# Altium schematic sheet STM32.SchDoc
size A3; DocumentNumber: 3; SheetNumber: 3; SheetTotal: 4
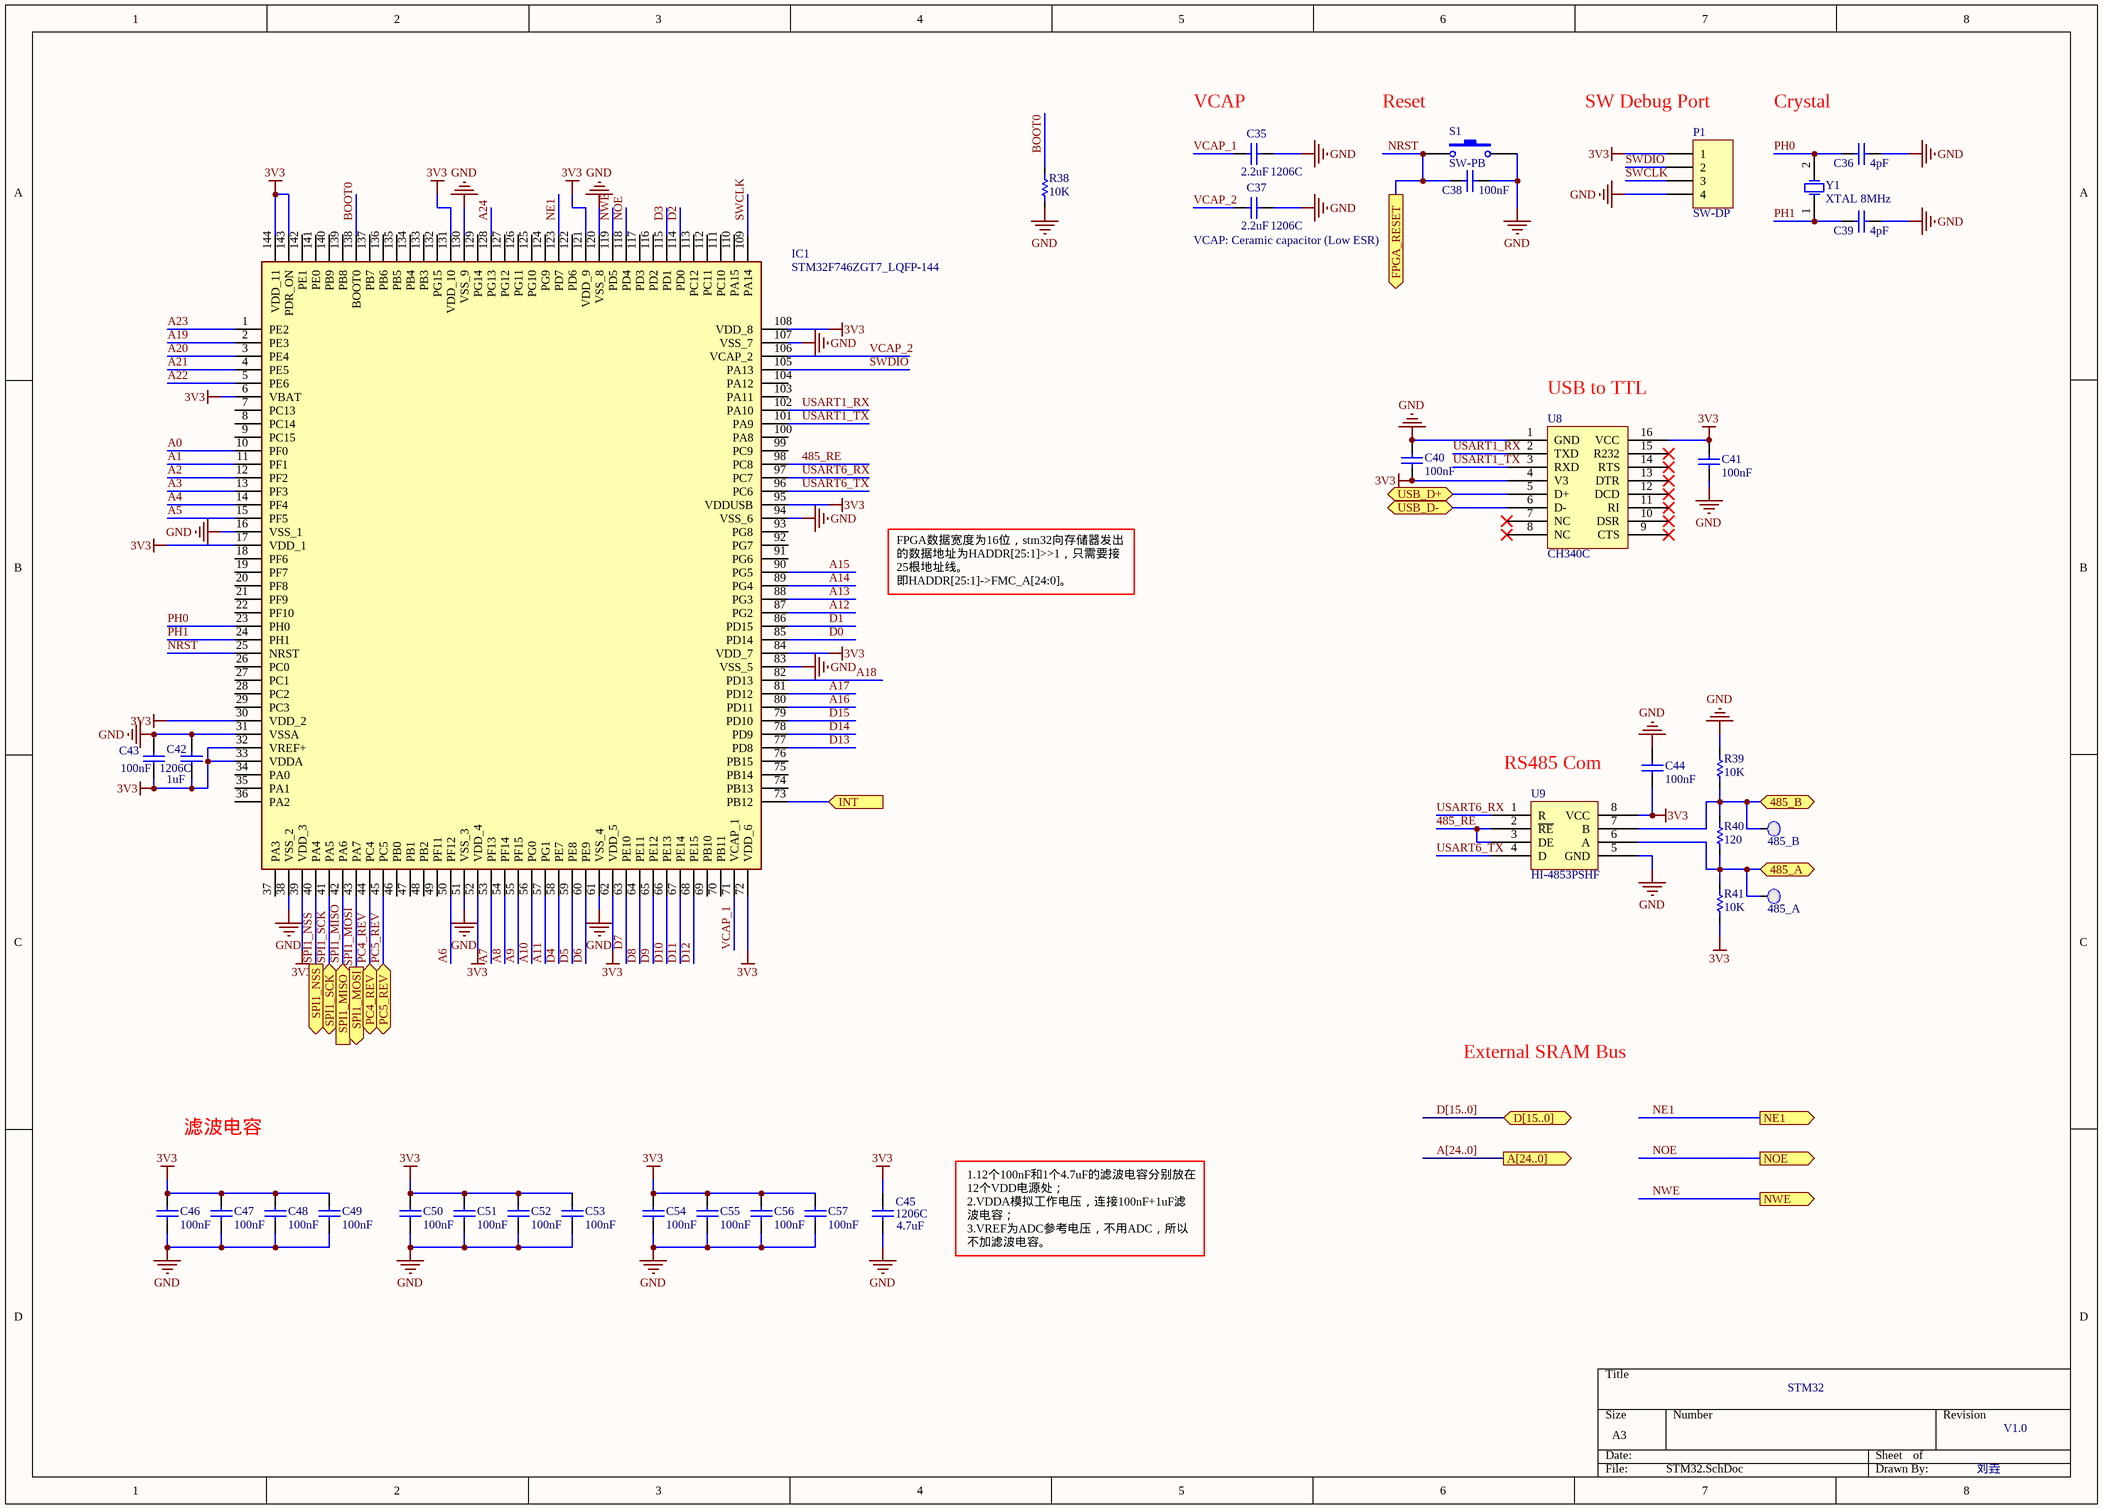
[diagram p0: STM32.SchDoc]

## Parts
485_A  TP  [TPA]  (value not drawn)
485_B  TP  [TPA]  (value not drawn)
C35  2.2uF  [1206C]
C36  4pF  [0805C]
C37  2.2uF  [1206C]
C38  100nF  [0805C]
C39  4pF  [0805C]
C40  100nF  [0805C]
C41  100nF  [0805C]
C42  1uF  [1206C]
C43  100nF  [0805C]
C44  100nF  [0805C]
C45  4.7uF  [1206C]
C46  100nF  [0805C]
C47  100nF  [0805C]
C48  100nF  [0805C]
C49  100nF  [0805C]
C50  100nF  [0805C]
C51  100nF  [0805C]
C52  100nF  [0805C]
C53  100nF  [0805C]
C54  100nF  [0805C]
C55  100nF  [0805C]
C56  100nF  [0805C]
C57  100nF  [0805C]
IC1  STM32F746ZGT7_LQFP-144  [QFP50P2200X2200X160-144N]
P1  SW-DP  [MHDR1X4]
R38  10K  [0805R]
R39  10K  [0805R]
R40  120  [0805R]
R41  10K  [0805R]
S1  SW-PB  [SW-SMD_L6.0-W3.5-LS8.0]
U8  CH340C  [CH340C]
U9  HI-4853PSHF  [SOIC-8N]
Y1  XTAL 8MHz  [NX3225GD8MHZSTDCRA3]

## Ports
485_A (bidir), 485_B (bidir), A[24..0] (out), D[15..0] (bidir), FPGA_RESET (out), INT (in), NE1 (out), NOE (out), NWE (out), PC4_REV (bidir), PC5_REV (bidir), SPI1_MISO (in), SPI1_MOSI (out), SPI1_NSS (out), SPI1_SCK (bidir), USB_D+ (bidir), USB_D- (bidir)

## Nets
3V3: C40.1 C41.2 C42.1 C43.1 C44.1 C45.2 C46.2 C47.2 C48.2 C49.2 C50.2 C51.2 C52.2 C53.2 C54.2 C55.2 C56.2 C57.2 IC1.6(VBAT) IC1.17(VDD_1) IC1.30(VDD_2) IC1.32(VREF+) IC1.33(VDDA) IC1.39(VDD_3) IC1.52(VDD_4) IC1.62(VDD_5) IC1.72(VDD_6) IC1.84(VDD_7) IC1.95(VDDUSB) IC1.108(VDD_8) IC1.121(VDD_9) IC1.131(VDD_10) IC1.143(PDR_ON) IC1.144(VDD_11) P1.1 R41.1 U8.4(V3) U8.16(VCC) U9.8(VCC)
GND: C35.1 C36.2 C37.1 C38.2 C39.2 C40.2 C41.1 C42.2 C43.2 C44.2 C45.1 C46.1 C47.1 C48.1 C49.1 C50.1 C51.1 C52.1 C53.1 C54.1 C55.1 C56.1 C57.1 IC1.16(VSS_1) IC1.31(VSSA) IC1.38(VSS_2) IC1.51(VSS_3) IC1.61(VSS_4) IC1.83(VSS_5) IC1.94(VSS_6) IC1.107(VSS_7) IC1.120(VSS_8) IC1.130(VSS_9) P1.4 R38.2 R39.2 S1.2 U8.1(GND) U9.5(GND)
485_A: 485_A.1(TP) R40.1 R41.2 U9.6(A) ; port 485_A
485_B: 485_B.1(TP) R39.1 R40.2 U9.7(B) ; port 485_B
485_RE: IC1.98(PC8) U9.2(~{RE}) U9.3(DE)
A0: IC1.10(PF0)
A1: IC1.11(PF1)
A2: IC1.12(PF2)
A3: IC1.13(PF3)
A4: IC1.14(PF4)
A5: IC1.15(PF5)
A6: IC1.50(PF12)
A7: IC1.53(PF13)
A8: IC1.54(PF14)
A9: IC1.55(PF15)
A10: IC1.56(PG0)
A11: IC1.57(PG1)
A12: IC1.87(PG2)
A13: IC1.88(PG3)
A14: IC1.89(PG4)
A15: IC1.90(PG5)
A16: IC1.80(PD11)
A17: IC1.81(PD12)
A18: IC1.82(PD13)
A19: IC1.2(PE3)
A20: IC1.3(PE4)
A21: IC1.4(PE5)
A22: IC1.5(PE6)
A23: IC1.1(PE2)
A24: IC1.128(PG13)
BOOT0: IC1.138(BOOT0) R38.1
D0: IC1.85(PD14)
D1: IC1.86(PD15)
D2: IC1.114(PD0)
D3: IC1.115(PD1)
D4: IC1.58(PE7)
D5: IC1.59(PE8)
D6: IC1.60(PE9)
D7: IC1.63(PE10)
D8: IC1.64(PE11)
D9: IC1.65(PE12)
D10: IC1.66(PE13)
D11: IC1.67(PE14)
D12: IC1.68(PE15)
D13: IC1.77(PD8)
D14: IC1.78(PD9)
D15: IC1.79(PD10)
INT: IC1.73(PB12) ; port INT
NE1: IC1.123(PD7) ; port NE1
NOE: IC1.118(PD4) ; port NOE
NRST: C38.1 IC1.25(NRST) S1.1 ; port FPGA_RESET
NWE: IC1.119(PD5) ; port NWE
PC4_REV: IC1.44(PC4) ; port PC4_REV
PC5_REV: IC1.45(PC5) ; port PC5_REV
PH0: C36.1 IC1.23(PH0) Y1.2(OSC2)
PH1: C39.1 IC1.24(PH1) Y1.1(OSC1)
SPI1_MISO: IC1.42(PA6) ; port SPI1_MISO
SPI1_MOSI: IC1.43(PA7) ; port SPI1_MOSI
SPI1_NSS: IC1.40(PA4) ; port SPI1_NSS
SPI1_SCK: IC1.41(PA5) ; port SPI1_SCK
SWCLK: IC1.109(PA14) P1.3
SWDIO: IC1.105(PA13) P1.2
USART1_RX: IC1.102(PA10) U8.2(TXD)
USART1_TX: IC1.101(PA9) U8.3(RXD)
USART6_RX: IC1.97(PC7) U9.1(R)
USART6_TX: IC1.96(PC6) U9.4(D)
USB_D+: U8.5(D+) ; port USB_D+
USB_D-: U8.6(D-) ; port USB_D-
VCAP_1: C35.2 IC1.71(VCAP_1)
VCAP_2: C37.2 IC1.106(VCAP_2)

Not connected (* = marked no-connect by the designer): IC1 7(PC13) 8(PC14) 9(PC15) 18(PF6) 19(PF7) 20(PF8) 21(PF9) 22(PF10) 26(PC0) 27(PC1) 28(PC2) 29(PC3) 34(PA0) 35(PA1) 36(PA2) 37(PA3) 46(PB0) 47(PB1) 48(PB2) 49(PF11) 69(PB10) 70(PB11) 74(PB13) 75(PB14) 76(PB15) 91(PG6) 92(PG7) 93(PG8) 99(PC9) 100(PA8) 103(PA11) 104(PA12) 110(PA15) 111(PC10) 112(PC11) 113(PC12) 116(PD2) 117(PD3) 122(PD6) 124(PG9) 125(PG10) 126(PG11) 127(PG12) 129(PG14) 132(PG15) 133(PB3) 134(PB4) 135(PB5) 136(PB6) 137(PB7) 139(PB8) 140(PB9) 141(PE0) 142(PE1); U8 7(NC)* 8(NC)* 9(CTS)* 10(DSR)* 11(RI)* 12(DCD)* 13(DTR)* 14(RTS)* 15(R232)*

## Buses and harness runs
bus A[24..0] = port A[24..0]
bus D[15..0] = port D[15..0]

## Notes on the sheet
- (near C35) VCAP
- (near S1) Reset
- (near P1) SW Debug Port
- Crystal
- (near C37) VCAP: Ceramic capacitor (Low ESR)
- (near U8) USB to TTL
- FPGA数据宽度为16位，stm32向存储器发出的数据地址为HADDR[25:1]>>1，只需要接25根地址线。
  即HADDR[25:1]->FMC_A[24:0]。
- RS485 Com
- External SRAM Bus
- 滤波电容
- 1.12个100nF和1个4.7uF的滤波电容分别放在12个VDD电源处；
  2.VDDA模拟工作电压，连接100nF+1uF滤波电容；
  3.VREF为ADC参考电压，不用ADC，所以不加滤波电容。
- STM32
- V1.0
- 刘垚

## Library data of the parts
C35-C57 = Cap: Capacitor; Published: 8-Jun-2000; LatestRevisionDate: 17-Jul-2002; LatestRevisionNote: Re-released for DXP Platform.; Publisher: Altium Limited; PackageDescription: Radial Cap, Thru-Hole; 2 Leads; 0.3 in Pin Spacing
  C35 C37: PackageReference: 1206C; Value: 2.2uF
  C36 C39: PackageReference: RAD-0.3; Value: 4pF
  C38 C40 C41 C43 C44 C46-C57: PackageReference: RAD-0.3; Value: 100nF
  C42: PackageReference: 1206C; Value: 1uF
  C45: PackageReference: 1206C; Value: 4.7uF
IC1 = STM32F746ZGT7: Integrated Circuit; Manufacturer_Name: STMicroelectronics; Datasheet Link: http://www.st.com/content/ccc/resource/technical/document/datasheet/96/ed/61/9b/e0/6c/45/0b/DM00166116.pdf/files/DM00166116.pdf/jcr:content/translations/en.DM00166116.pdf; Height: 1.6mm; Manufacturer_Part_Number: STM32F746ZGT7; Mouser Part Number: 511-STM32F746ZGT7; Mouser Price/Stock: https://www.mouser.co.uk/ProductDetail/STMicroelectronics/STM32F746ZGT7?qs=BA62vJVifGozpDSWhcdUmw%3D%3D
P1 = MHDR1X4: Header, 4-Pin; LatestRevisionDate: 17-Jul-2002; LatestRevisionNote: Re-released for DXP Platform.; Publisher: Altium Limited
R38-R41 = Res1: Resistor; Published: 8-Jun-2000; LatestRevisionDate: 17-Jul-2002; LatestRevisionNote: Re-released for DXP Platform.; PackageReference: AXIAL-0.3; Publisher: Altium Limited; PackageDescription: Axial Device, Thru-Hole; 2 Leads; 0.3 in Pin Spacing
  R38 R39 R41: Value: 10K
  R40: Value: 120
S1 = SW-PB: Switch; Published: 24-Mar-1999; LatestRevisionDate: 17-Jul-2002; LatestRevisionNote: Re-released for DXP Platform.; PackageReference: SPST-2; Publisher: Altium Limited; PackageDescription: Switch; 2 Leads
Y1 = XTAL: Crystal Oscillator; Published: 8-Jun-2000; LatestRevisionDate: 17-Jul-2002; LatestRevisionNote: Re-released for DXP Platform.; PackageReference: R38; Publisher: Altium Limited